# EAGLE design rfid_wifi_tft (EAGLE 7.6.0)

## Sheet 1 of 2
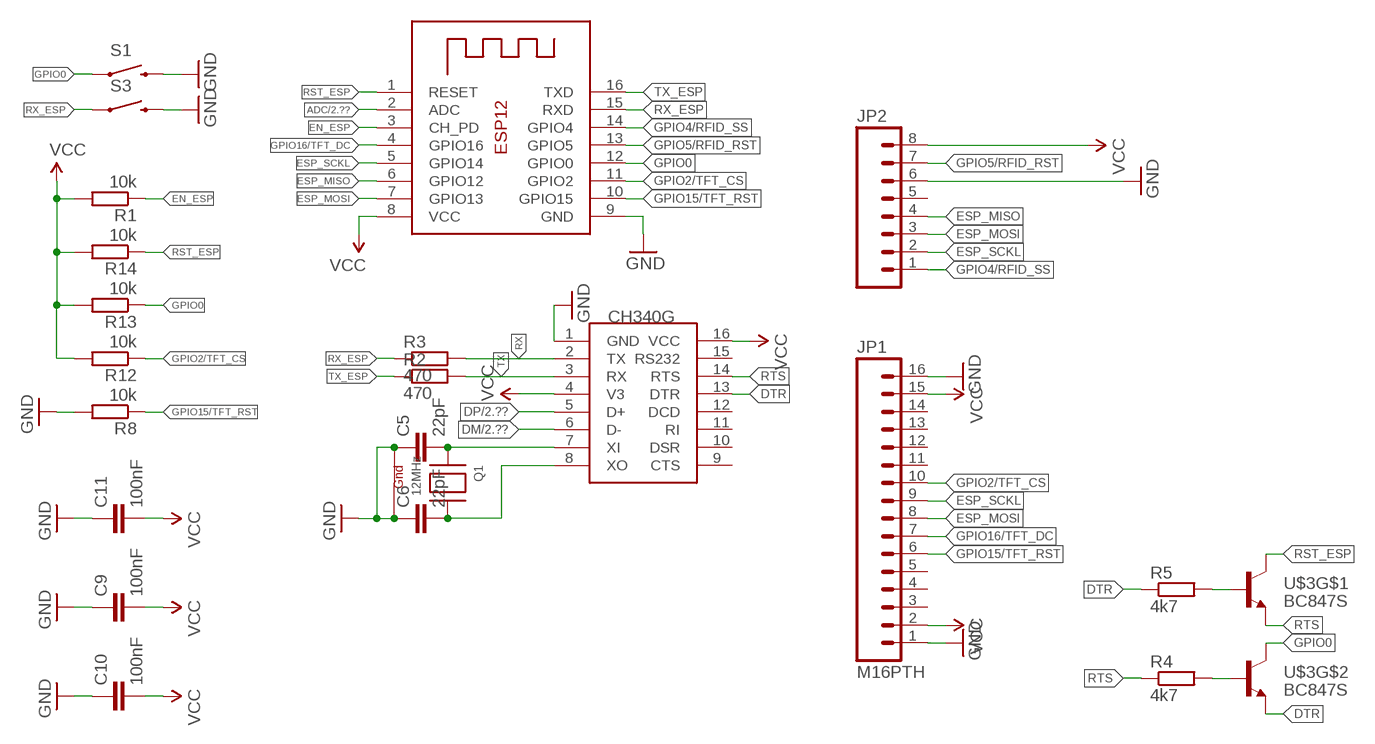
[diagram p0: schematic, sheet 1]

### Parts
C5  22pF  C-EUC0805  [C0805]
C6  22pF  C-EUC0805  [C0805]
C9  100nF  C-EUC0805  [C0805]
C10  100nF  C-EUC0805  [C0805]
C11  100nF  C-EUC0805  [C0805]
CH340G  CH340GCH340G  [SOIC16]
JP1  M16PTH  [1X16]
JP2  M08  [1X08_ROUND]
Q1  12MHz  XTAL-4-3225  [NX3225]
R1  10k  R-EU_R0603  [R0603]
R2  470  R-EU_R0603  [R0603]
R3  470  R-EU_R0603  [R0603]
R4  4k7  R-EU_R0603  [R0603]
R5  4k7  R-EU_R0603  [R0603]
R8  10k  R-EU_R0603  [R0603]
R12  10k  R-EU_R0603  [R0603]
R13  10k  R-EU_R0603  [R0603]
R14  10k  R-EU_R0603  [R0603]
S1  SWITCH-MOMENTARY-2-SMD-1101NE  [TACTILE-SWITCH-1101NE]
S3  SWITCH-MOMENTARY-2-SMD-1101NE  [TACTILE-SWITCH-1101NE]
U$3  BC847S  MMDT3904  [SOT363]
X1  ESP-12  [ESP-12]

### Nets
ADC: X1.2(ADC) ; also sheet 2
DM: CH340G.6(D-) ; also sheet 2
DP: CH340G.5(D+) ; also sheet 2
DTR: CH340G.13(DTR) R5.1 U$3.1(E)
EN_ESP: R1.1 X1.3(CH_PD)
ESP_MISO: JP2.4 X1.6(GPIO12)
ESP_MOSI: JP1.8 JP2.3 X1.7(GPIO13)
ESP_SCKL: JP1.9 JP2.2 X1.5(GPIO14)
GND: C5.1 C6.1 C9.1 C10.1 C11.1 CH340G.1(GND) JP1.1 JP1.16 JP2.6 Q1.2(G2) Q1.4(G1) R8.2 S1.P$2 S3.P$2 X1.9(GND) ; also sheet 2
GPIO0: R13.1 S1.P$1 U$3.6(C) X1.12(GPIO0)
GPIO2/TFT_CS: JP1.10 R12.1 X1.11(GPIO2)
GPIO4/RFID_SS: JP2.1 X1.14(GPIO4)
GPIO5/RFID_RST: JP2.7 X1.13(GPIO5)
GPIO15/TFT_RST: JP1.6 R8.1 X1.10(GPIO15)
GPIO16/TFT_DC: JP1.7 X1.4(GPIO16)
N$17: C5.2 CH340G.7(XI) Q1.1(X1)
N$24: C6.2 CH340G.8(XO) Q1.3(X2)
N$25: R5.2 U$3.5(B)
N$28: R4.2 U$3.2(B)
RST_ESP: R14.1 U$3.3(C) X1.1(RESET)
RTS: CH340G.14(RTS) R4.1 U$3.4(E)
RX: CH340G.2(TX) R3.2
RX_ESP: R3.1 S3.P$1 X1.15(RXD)
TX: CH340G.3(RX) R2.2
TX_ESP: R2.1 X1.16(TXD)
VCC: C9.2 C10.2 C11.2 CH340G.4(V3) CH340G.16(VCC) JP1.2 JP1.15 JP2.8 R1.2 R12.2 R13.2 R14.2 X1.8(VCC) ; also sheet 2
Unconnected: CH340G.9(CTS) CH340G.10(DSR) CH340G.11(RI) CH340G.12(DCD) CH340G.15(RS232) JP1.3 JP1.4 JP1.5 JP1.11 JP1.12 JP1.13 JP1.14 JP2.5

## Sheet 2 of 2
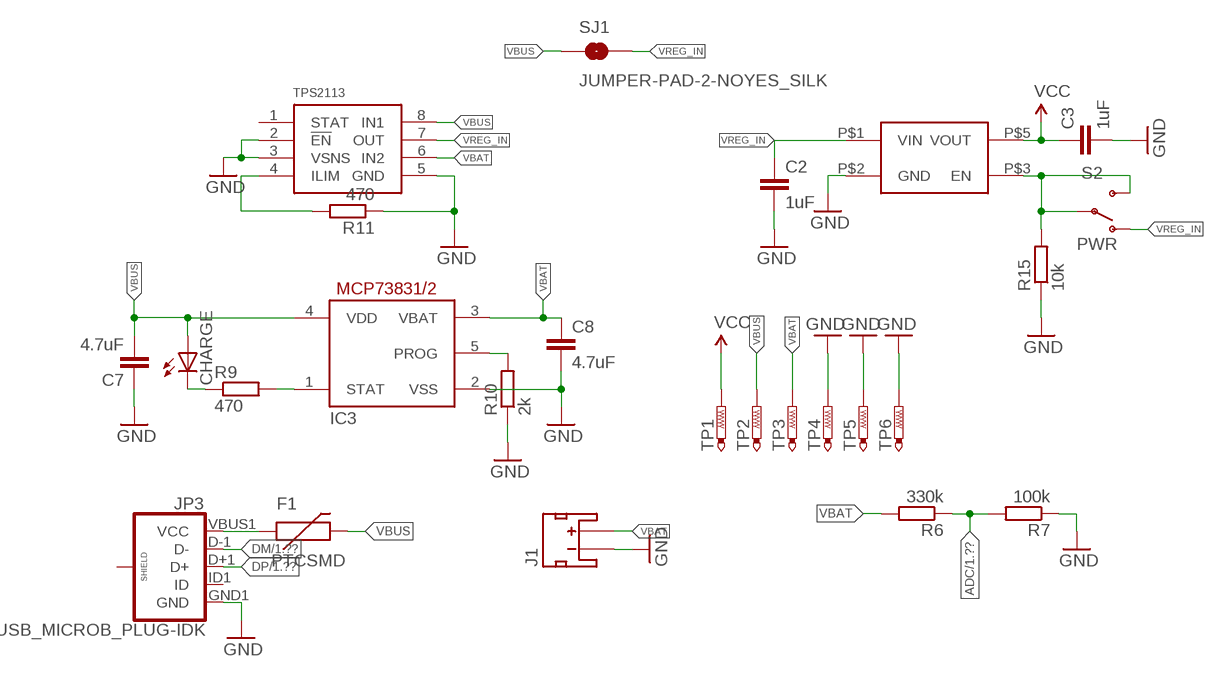
[diagram p1: schematic, sheet 2]

### Parts
C2  1uF  C-EUC0805  [C0805]
C3  1uF  C-EUC0805  [C0805]
C7  4.7uF  C-EUC0805  [C0805]
C8  4.7uF  C-EUC0805  [C0805]
CHARGE  LEDCHIP-LED0805  [CHIP-LED0805]
F1  PTCSMD  [PTC-1206]
IC3  MCP73831  MCP73831/OT  [SOT23-5L]
J1  JST_2MM_MALE  [JST-2-SMD]
JP3  USB_MICROB_PLUG-IDK  [USB-AB-MICRO-SMD_SLOT]
R6  330k  R-EU_R0603  [R0603]
R7  100k  R-EU_R0603  [R0603]
R9  470  R-EU_R0603  [R0603]
R10  2k  R-EU_R0603  [R0603]
R11  470  R-EU_R0603  [R0603]
R15  10k  R-EU_R0603  [R0603]
S2  PWR  SWITCH-SPDT-SMD-A  [SWITCH-SPST-SMD-A]
SJ1  JUMPER-PAD-2-NOYES_SILK  [PAD-JUMPER-2-NO_YES_SILK]
TP1  PTR1B1,27  [B1,27]
TP2  PTR1B1,27  [B1,27]
TP3  PTR1B1,27  [B1,27]
TP4  PTR1B1,27  [B1,27]
TP5  PTR1B1,27  [B1,27]
TP6  PTR1B1,27  [B1,27]
U$4  TPS2113-PW  [TEXAS-PW]
U$9  AP2112KAP2112K  [AP2112]

### Nets
ADC: R6.1 R7.2 ; also sheet 1
DM: JP3.D-1(D-) ; also sheet 1
DP: JP3.D+1(D+) ; also sheet 1
GND: C2.2 C3.2 C7.1 C8.2 IC3.2(VSS) J1.1(-) JP3.GND1(GND) R7.1 R10.1 R11.1 R15.1 TP4.TP TP5.TP TP6.TP U$4.2(!EN) U$4.3(VSNS) U$4.5(GND) U$9.P$2(GND) ; also sheet 1
N$12: IC3.1(STAT) R9.2
N$15: CHARGE.C R9.1
N$20: R11.2 U$4.4(ILIM)
N$21: IC3.5(PROG) R10.2
VBAT: C8.1 IC3.3(VBAT) J1.2(+) R6.2 TP3.TP U$4.6(IN2)
VBUS: C7.2 CHARGE.A F1.2 IC3.4(VDD) SJ1.1 TP2.TP U$4.8(IN1)
VCC: C3.1 TP1.TP U$9.P$5(VOUT) ; also sheet 1
VREG_EN: R15.2 S2.2(P) S2.3(S) U$9.P$3(EN)
VREG_IN: C2.1 S2.1(O) SJ1.2 U$4.7(OUT) U$9.P$1(VIN)
VUSB: F1.1 JP3.VBUS1(VCC)
Unconnected: J1.NC1(PAD1) J1.NC2(PAD2) JP3.ID1(ID) JP3.P$1(SHIELD) JP3.P$2(SHIELD) JP3.P$3(SHIELD) JP3.P$4(SHIELD) U$4.1(STAT)

## Library data of the parts
C2 C3 C5-C11 = rcl:C-EU: CAPACITOR, European symbol
CH340G = ch340g:CH340G: USB to TTL RS232 converter
CHARGE = led:LED: LED OSRAM: - CHIPLED LG R971, LG N971, LY N971, LG Q971, LY Q971, LO R971, LY R971 LH N974, LH R974 LS Q976, LO Q976, LY Q976 LO Q996 - Hyper CHIPLED LW Q18S LB Q993, LB Q99A, LB R99A - SideLED LS A670, LO A670, LY A670, LG A670, LP A670 LB A673, LV A673, LT A673, LW A673 LH A674 LY A675 LS A676, LA A676, LO A676, LY A676, LW A676 LS A679, LY A679, LG A679 - Hyper Micro SIDELED® LS Y876, LA Y876, LO Y876, LY Y876 LT Y87S - SmartLED LW L88C, LW L88S LB L89C, LB L89S, LG L890 LS L89K, LO L89K, LY L89K LS L896, LA L896, LO L896, LY L896 - TOPLED LS T670, LO T670, LY T670, LG T670, LP T670 LSG T670, LSP T670, LSY T670, LOP T670, LYG T670 LG T671, LOG T671, LSG T671 LB T673, LV T673, LT T673, LW T673 LH T674 LS T676, LA T676, LO T676, LY T676, LB T676, LH T676, LSB T676, LW T676 LB T67C, LV T67C, LT T67C, LS T67K, LO T67K, LY T67K, LW E67C LS E67B, LA E67B, LO E67B, LY E67B, LB E67C, LV E67C, LT E67C LW T67C LS T679, LY T679, LG T679 LS T770, LO T770, LY T770, LG T770, LP T770 LB T773, LV T773, LT T773, LW T773 LH T774 LS E675, LA E675, LY E675, LS T675 LS T776, LA T776, LO T776, LY T776, LB T776 LHGB T686 LT T68C, LB T68C - Hyper Mini TOPLED® LB M676 - Mini TOPLED Santana® LG M470 LS M47K, LO M47K, LY M47K Source: http://www.osram.convergy.de LUXEON: - LUMILED® LXK2-PW12-R00, LXK2-PW12-S00, LXK2-PW14-U00, LXK2-PW14-V00 LXK2-PM12-R00, LXK2-PM12-S00, LXK2-PM14-U00 LXK2-PE12-Q00, LXK2-PE12-R00, LXK2-PE12-S00, LXK2-PE14-T00, LXK2-PE14-U00 LXK2-PB12-K00, LXK2-PB12-L00, LXK2-PB12-M00, LXK2-PB14-N00, LXK2-PB14-P00, LXK2-PB14-Q00 LXK2-PR12-L00, LXK2-PR12-M00, LXK2-PR14-Q00, LXK2-PR14-R00 LXK2-PD12-Q00, LXK2-PD12-R00, LXK2-PD12-S00 LXK2-PH12-R00, LXK2-PH12-S00 LXK2-PL12-P00, LXK2-PL12-Q00, LXK2-PL12-R00 Source: www.luxeon.com KINGBRIGHT: KA-3528ASYC Source: www.kingbright.com
F1 = SparkFun-PowerIC:PTC: Resettable Fuse PTC Resettable Fuse. Spark Fun Electronics SKU : COM-08357; PROD_ID: RES-11150
IC3 = adafruit:MCP73831: MCP73831/2 Miniature Single-Cell, Fully Integrated Li-Ion, Li-Polymer Charge Management Controllers. Nice and small simple lipoly charge controller, with adjustable current and status output (LED) http://www.ladyada.net/library/pcb/eaglelibrary.html
J1 = SparkFun-Connectors:JST_2MM_MALE: Mates to single-cell LiPo batteries. CONN-08352; PROD_ID: CONN-08352
JP1 = SparkFun-Connectors:M16: 1x16 .1" header
JP2 = SparkFun-Connectors:M08: Header 8 Standard 8-pin 0.1" header. Use with straight break away headers (SKU : PRT-00116), right angle break away headers (PRT-00553), swiss pins (PRT-00743), machine pins (PRT-00117), and female headers (PRT-00115).
JP3 = SparkFun-Connectors:USB_MICROB_PLUG: USB Micro-B connectors Some male, some female. Watch your step!
Q1 = adafruit:XTAL-4: Classic 4-pin 3.2 x 2.5mm crystal
R1-R15 = rcl:R-EU_: RESISTOR, European symbol
S1 S3 = SparkFun-Electromechanical:SWITCH-MOMENTARY-2: Various NO switches- pushbuttons, reed, etc
S2 = SparkFun-Electromechanical:SWITCH-SPDT: SPDT Switch Simple slide switch, Spark Fun Electronics SKU : COM-00102 DPDT SMT slide switch, AYZ0202, SWCH-08179
SJ1 = SparkFun-Passives:JUMPER-PAD-2-NO
TP1-TP6 = testpad:PTR1: TEST PIN
U$3 = SparkFun-DiscreteSemi:MMDT3904: Dual NPN transistor
U$4 = TPS2113:TPS2113-PW
U$9 = TPS2113:AP2112K
X1 = adafruit:ESP-12

## Board
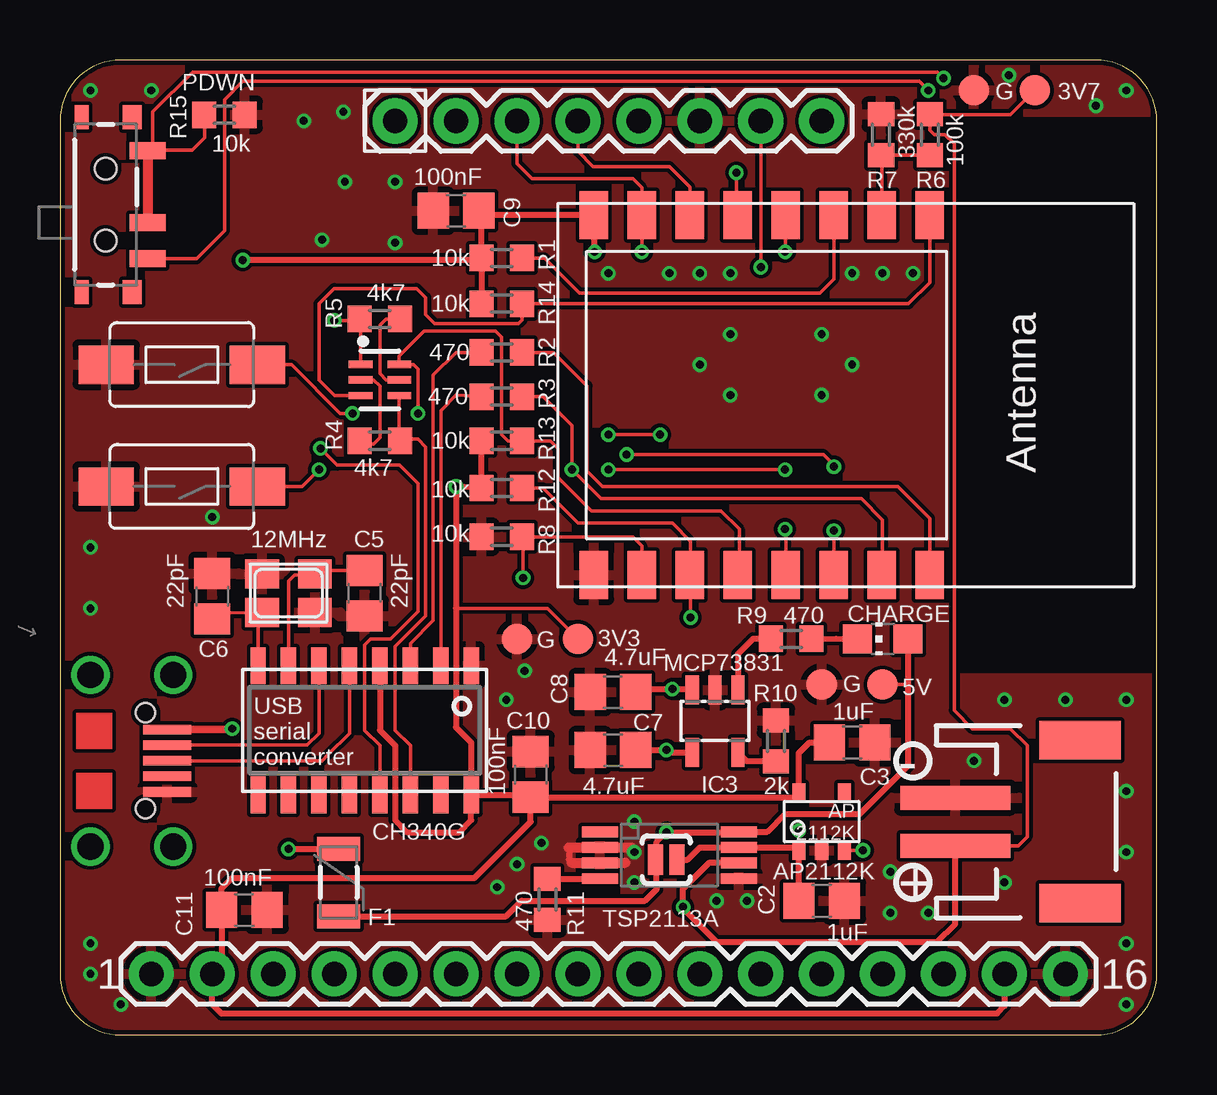
[diagram p2: board, top side]
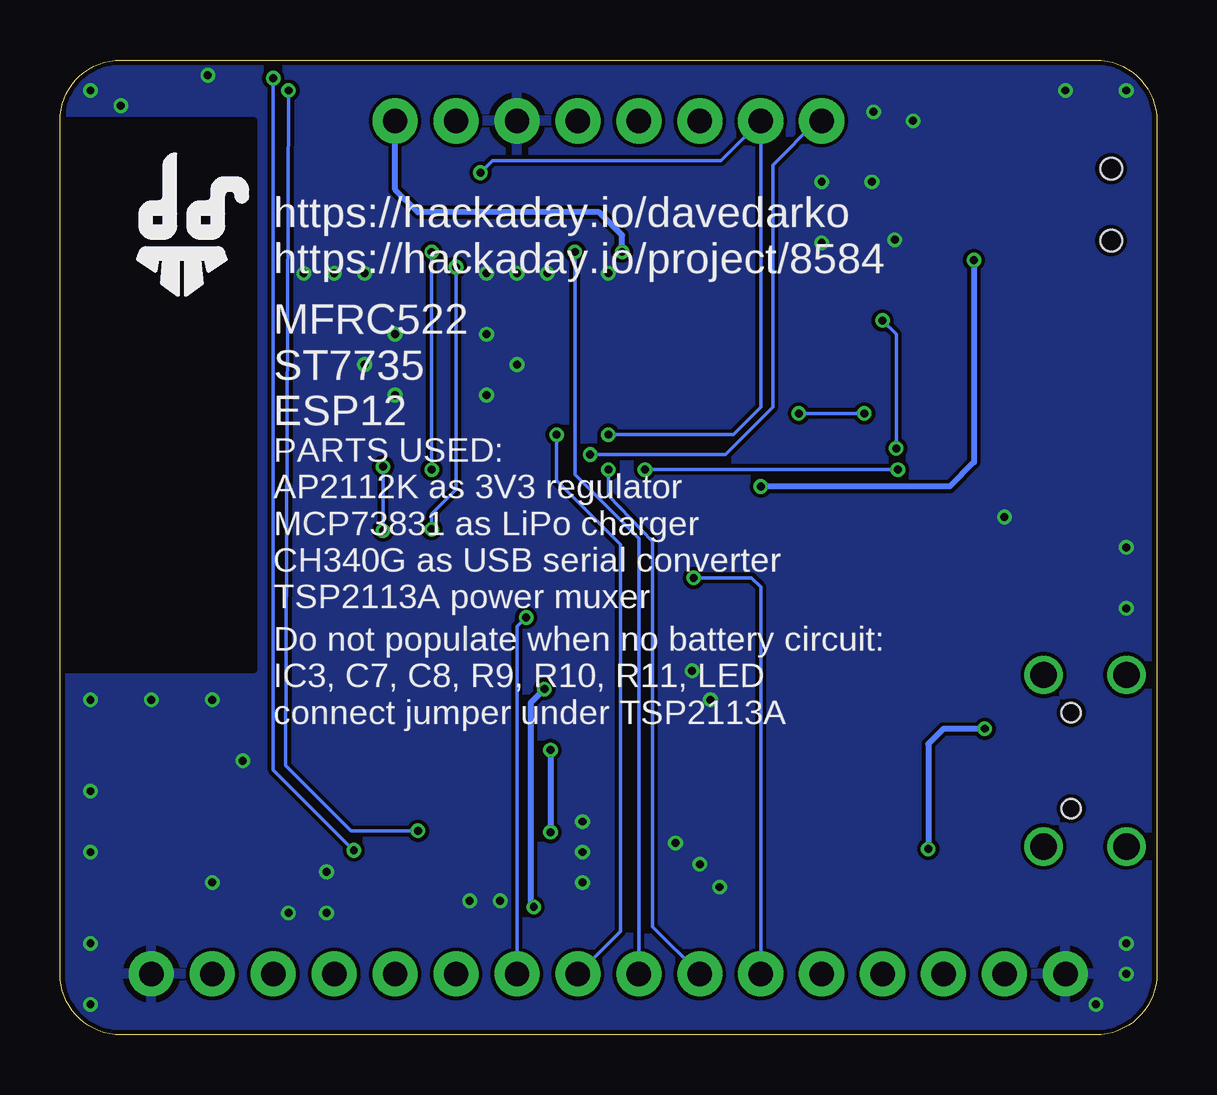
[diagram p3: board, bottom side, seen from below]

Size 45.72 x 40.64 mm. Coordinates in mm from the lower left corner, seen from the top.
Outline: 0,38.1 0,2.54 arc90 2.54,0 43.18,0 arc90 45.72,2.54 45.72,38.1 arc90 43.18,40.64 2.54,40.64 arc90 0,38.1
Copper layers (1*16): Top 0.035mm / dielectric 1.5mm / Bottom 0.035mm
Design rules "aisler_go_2layer *": minimum track width 0.1mm, minimum drill 0.2mm, track to track 0.1mm, track to pad 0.1mm, pad to pad 0.1mm, via to via 0.1mm, smd to smd 0.1mm, copper to edge 0.2mm, drill to drill 0.21mm, minimum pad ring 0.25mm, minimum via ring 0.05mm, stop-mask expansion 0.01mm, vias tented up to drill 200mil, thermal gap 10mil
tRestrict: area 37.7,15.2 to 45.3,38.1
bRestrict: area 37.7,15.2 to 45.3,38.1

### Footprints (pad centres in the part's own frame; a part is rotated, then mirrored left to right if it is on the bottom)
C0805 = smd 1.3 x 1.5: 1 -0.95,0; 2 0.95,0
SOIC16 = smd 0.635 x 1.524: 1 -4.445,-2.695; 2 -3.175,-2.695; 3 -1.905,-2.695; 4 -0.635,-2.695; 5 0.635,-2.695; 6 1.905,-2.695; 7 3.175,-2.695; 8 4.445,-2.695; 9 4.445,2.695; 10 3.175,2.695; 11 1.905,2.695; 12 0.635,2.695; 13 -0.635,2.695; 14 -1.905,2.695; 15 -3.175,2.695; 16 -4.445,2.695
CHIP-LED0805 = smd 1.2 x 1.2: A 0,-1.05; C 0,1.05
PTC-1206 = smd 1 x 1.8: 1 -1.4,0; 2 1.4,0
SOT23-5L = smd 0.55 x 1.2: 1 -0.95,-1.3; 2 0,-1.3; 3 0.95,-1.3; 4 0.95,1.3; 5 -0.95,1.3
JST-2-SMD = smd 1 x 4.6: 1 -1,-3.7; 2 1,-3.7 | smd 1.6 x 3.4: NC1 -3.4,1.5; NC2 3.4,1.5
1X16 = drill 1.016 pad 1.88: 1 0,0; 2 2.54,0; 3 5.08,0; 4 7.62,0; 5 10.16,0; 6 12.7,0; 7 15.24,0; 8 17.78,0; 9 20.32,0; 10 22.86,0; 11 25.4,0; 12 27.94,0; 13 30.48,0; 14 33.02,0; 15 35.56,0; 16 38.1,0
1X08_ROUND = drill 1.016 pad 1.88: 1 0,0; 2 2.54,0; 3 5.08,0; 4 7.62,0; 5 10.16,0; 6 12.7,0; 7 15.24,0; 8 17.78,0
USB-AB-MICRO-SMD_SLOT = smd 2 x 0.4: D+1 3.2,0; D-1 3.2,0.65; GND1 3.2,-1.3; ID1 3.2,-0.65; VBUS1 3.2,1.3 | drill 1.1: P$1 0,3.575; P$2 0,-3.575; P$3 3.45,-3.575; P$4 3.45,3.575 | hole 0.8: 2.3,2; 2.3,-2
NX3225 = smd 1.4 x 1.2: 1 -1.1,-0.8; 2 1.1,-0.8; 3 1.1,0.8; 4 -1.1,0.8
R0603 = smd 1 x 1.1: 1 -0.85,0; 2 0.85,0
TACTILE-SWITCH-1101NE = smd 2.3 x 1.6: P$1 -3.15,0; P$2 3.15,0
SWITCH-SPST-SMD-A = smd 0.7 x 1.5: 1 -2.25,-1.75; 2 -0.75,-1.75; 3 2.25,-1.75 | smd 1 x 0.6: GND1 -3.65,1; GND3 3.65,1 | smd 1 x 0.8: GND2 -3.65,-1.1; GND4 3.65,-1.1 | hole 0.9: -1.5,0; 1.5,0
PAD-JUMPER-2-NO_YES_SILK = smd 0.635 x 1.27: 1 -0.45,0; 2 0.45,0
B1,27 = smd 1.27 x 1.27: TP 0,0
SOT363 = smd 0.3 x 0.99: 1 -0.65,-0.8; 2 0,-0.8; 3 0.65,-0.8; 4 0.65,0.81; 5 0,0.81; 6 -0.65,0.81
TEXAS-PW = smd 1.5 x 0.45: 1 -2.9,0.975; 2 -2.9,0.325; 3 -2.9,-0.325; 4 -2.9,-0.975; 5 2.9,-0.975; 6 2.9,-0.325; 7 2.9,0.325; 8 2.9,0.975
AP2112 = smd 0.55 x 0.8: P$1 0.95,1.2; P$2 0,1.2; P$3 -0.95,1.2; P$4 -0.95,-1.2; P$5 0.95,-1.2
ESP-12 = smd 2 x 1.2: 1 -7.5,4.5; 2 -7.5,2.5; 3 -7.5,0.5; 4 -7.5,-1.5; 5 -7.5,-3.5; 6 -7.5,-5.5; 7 -7.5,-7.5; 8 -7.5,-9.5; 9 7.5,-9.5; 10 7.5,-7.5; 11 7.5,-5.5; 12 7.5,-3.5; 13 7.5,-1.5; 14 7.5,0.5; 15 7.5,2.5; 16 7.5,4.5

### Placement (x,y rotation side)
C2  31.75,5.59 0 top
C3  33.02,12.19 0 top
C5  12.7,18.41 90 top
C6  6.35,18.29 270 top
C7  23.05,11.87 0 top
C8  23.05,14.29 180 top
C9  16.51,34.35 0 top
C10  19.62,10.86 270 top
C11  7.68,5.21 180 top
CH340G  12.7,12.7 180 top
CHARGE  34.29,16.51 90 top
F1  11.62,6.35 270 top
IC3  27.3,13.08 180 top
J1  41.02,8.89 270 top
JP1  3.81,2.54 0 top
JP2  13.97,38.1 0 top
JP3  1.27,11.43 0 top
Q1  9.53,18.41 180 top
R1  18.41,32.38 180 top
R2  18.41,28.45 180 top
R3  18.41,26.61 180 top
R4  13.34,24.77 180 top
R5  13.34,29.84 0 top
R6  36.26,37.53 90 top
R7  34.23,37.53 270 top
R8  18.41,20.76 180 top
R9  30.48,16.51 180 top
R10  29.84,12.26 270 top
R11  20.32,5.65 90 top
R12  18.41,22.8 180 top
R13  18.41,24.77 180 top
R14  18.41,30.48 180 top
R15  6.86,38.35 180 top
S1  5.08,27.94 180 top
S2  1.91,34.61 90 top
S3  5.08,22.86 180 top
SJ1  25.27,7.3 0 top
TP1  21.59,16.51 0 top
TP2  34.29,14.61 0 top
TP3  40.64,39.37 0 top
TP4  31.75,14.61 0 top
TP5  38.1,39.37 0 top
TP6  19.05,16.51 0 top
U$1  [DAVEDARKO_GOLD]  9.59,34.99 0 top
U$2  [DAVEDARKO2_LOGO]  40.64,33.02 0 bottom
U$3  13.34,27.3 270 top
U$4  25.4,7.49 0 top
U$9  31.75,8.89 180 top
X1  31.75,26.67 270 top

### Tracks (layer width: path | path; a pad name or v marks a point on that pad's centre or on a via)
ADC
  Top 0.152: X1.2 34.25,36.64 R7.2 R6.1
DM
  Top 0.152: CH340G.6 10.79,12.57 10.3,12.08 JP3.D-1
DP
  Top 0.152: CH340G.5 12.06,12.57 11.18,11.68 10.92,11.43 JP3.D+1
DTR  (via drill 0.33 pad 0.61)
  Top 0.152: U$3.1 12.54,29.8 R5.1 12.42,29.78 v11.43,29.78 | CH340G.13 13.34,12.06 12.7,12.7 12.7,16.26 12.95,16.51 13.78,16.51 14.92,17.65 14.92,22.99 14.16,23.75 11.56,23.75 v10.86,24.45
  Bottom 0.152: v10.86,24.45 10.86,29.21 v11.43,29.78
EN_ESP
  Top 0.152: X1.3 32.25,33.14 32.26,31.5 31.69,30.92 21.65,30.92 20.19,32.38 R1.1
ESP_MISO
  Top 0.152: X1.6 26.25,35.34 25.4,36.2 22.23,36.2 21.59,36.83 JP2.4
ESP_MOSI  (via drill 0.33 pad 0.61)
  Top 0.152: JP2.3 19.05,36.32 19.68,35.69 23.88,35.69 24.25,35.31 X1.7 v24.26,32.64
  Bottom 0.152: JP1.8 21.59,20.7 24.26,23.37 v24.26,32.64
ESP_SCKL  (via drill 0.33 pad 0.61)
  Top 0.152: v28.19,35.94 28.19,34.23 X1.5 | v25.02,25.02 v22.86,25.02
  Bottom 0.152: v28.19,35.94 27.69,36.45 18.16,36.45 JP2.2 16.51,26.16 17.65,25.02 v22.86,25.02 | JP1.9 22.35,4.32 22.35,20.45 25.02,23.11 v25.02,25.02
GND  (via drill 0.33 pad 0.61)
  Top 0.254: 21.21,7.81 21.21,7.3 21.34,7.18 | U$4.3 23.55,7.17 23.56,7.18
  Top 0.406: 21.34,7.18 23.56,7.18 | 21.21,7.81 23.81,7.81
  other vias: 23.94,7.62 23.94,6.35 23.94,8.89 28.64,5.59 27.37,5.59 19.05,7.11 18.22,6.16 20.07,8 34.61,6.79 39.37,6.35 36.2,5.08 44.45,7.62 44.45,13.97 44.45,3.81 41.91,13.97 44.45,10.16 18.61,13.97 19.37,15.18 27.94,29.21 27.94,26.67 26.67,27.94 31.75,29.21 33.02,27.94 31.75,26.67 43.18,38.73 44.45,1.27 44.45,39.37 39.56,40.01 11.81,38.48 10.16,38.1 11.87,35.56 13.97,35.56 10.92,33.15 13.97,33.02 1.27,39.37 3.81,39.37 6.35,21.59 1.27,17.78 1.27,20.32 2.54,1.27 1.27,2.54 1.27,3.81 34.61,5.08 38.1,11.43 39.37,13.97 33.02,31.75 34.29,31.75 35.56,31.75 27.94,31.75 26.67,31.75 25.4,31.75 22.86,31.75
  pour Bottom (isolate 0.152): 48.26,41.99 -2.54,41.99 -2.54,-1.27 48.26,-1.27
  pour Top (isolate 0.152): -1.27,43.18 46.99,43.18 46.99,-2.54 -1.27,-2.54
GPIO0  (via drill 0.33 pad 0.61)
  Top 0.152: X1.12 28.32,19.24 28.32,21.08 27.56,21.84 22.16,21.84 20.77,23.24 20.77,24.45 20.45,24.77 R13.1 18.67,24.77 18.41,25.02 18.41,29.08 18.16,29.34 15.18,29.34 14.14,28.3 U$3.6 14.73,27.94 14.92,27.75 v14.92,25.91 | S1.P$1 9.65,27.94 11.68,25.91 v12.19,25.91
  Bottom 0.152: v12.19,25.91 v14.92,25.91
GPIO2/TFT_CS  (via drill 0.33 pad 0.61)
  Top 0.152: v26.29,17.4 26.29,19.13 X1.11 26.29,19.21 26.29,20.57 25.53,21.34 21.59,21.34 20.13,22.8 R12.1
  Bottom 0.152: JP1.10 26.67,17.02 v26.29,17.4
GPIO4/RFID_SS  (via drill 0.33 pad 0.61)
  Top 0.152: X1.14 v32.25,21.01 v32.26,21.02 | v32.26,23.69 32.26,23.75 31.81,24.19 v23.62,24.19
  Bottom 0.152: v32.26,21.02 v32.26,23.69 | v23.62,24.19 17.97,24.19 16,26.16 16,36.26 14.16,38.1 JP2.1
GPIO5/RFID_RST  (via drill 0.33 pad 0.61)
  Top 0.152: X1.13 30.25,21.06 v30.23,21.08 | v29.21,32 JP2.7
  Bottom 0.152: v30.23,21.08 30.23,21.72 29.21,22.73 v29.21,32
GPIO15/TFT_RST  (via drill 0.33 pad 0.61)
  Top 0.152: X1.10 24.26,20.38 23.88,20.77 R8.1 19.3,20.92 v19.3,19.05
  Top 0.254: X1.10
  Bottom 0.152: JP1.6 16.51,18.67 16.89,19.05 v19.3,19.05
GPIO16/TFT_DC  (via drill 0.33 pad 0.61)
  Top 0.152: v30.23,32.64 30.25,33.63 X1.4 | v22.86,23.56 v30.23,23.56
  Bottom 0.152: JP1.7 21.02,4.51 21.02,20.57 22.86,22.48 v22.86,23.56 | v30.23,23.56 v30.23,32.64
N$12
  Top 0.254: R9.2 28.89,16.51 28.26,15.88 IC3.1
N$15
  Top 0.254: R9.1 32.35,16.52 CHARGE.C
N$17
  Top 0.152: CH340G.7 9.53,18.92 9.78,19.18 10.33,19.18 Q1.1 | 10.52,19.36 Q1.1 | C5.2 10.47,19.36 Q1.1
N$20
  Top 0.254: R11.2 22.48,6.5 U$4.4
N$21
  Top 0.254: 28.39,11.85 IC3.5 28.63,11.4 R10.2
N$24
  Top 0.152: C6.2 6.43,17.59 Q1.3 8.26,17.53 CH340G.8
N$25
  Top 0.152: R5.2 13.59,29.84 13.34,29.59 13.34,27.56 13.59,27.3 U$3.5
N$28
  Top 0.152: U$3.2 13.08,27.3 13.34,27.05 13.34,24.89 13.08,24.64 12.61,24.64 R4.2
RST_ESP
  Top 0.152: U$3.3 11.45,26.66 10.79,27.3 10.79,30.48 11.43,31.11 14.86,31.11 15.24,30.73 15.24,30.04 15.62,29.65 19.11,29.65 19.27,29.81 R14.1 35.37,30.48 36.26,31.37 X1.1
RTS
  Top 0.152: U$3.4 14.14,24.8 R4.1 14.25,24.83 14.92,24.83 15.24,24.51 15.24,17.46 13.97,16.19 13.97,12.7 14.61,12.06 CH340G.14
RX
  Top 0.152: CH340G.2 15.88,26.04 16.51,26.67 R3.2
RX_ESP  (via drill 0.33 pad 0.61)
  Top 0.152: X1.15 34.29,19.21 34.29,21.46 33.4,22.35 22.54,22.35 v21.34,23.56 21.34,25.4 20.13,26.61 R3.1 | S3.P$1 10.1,22.86 v10.79,23.56
  Bottom 0.152: v10.79,23.56 v21.34,23.56
TX
  Top 0.152: CH340G.3 14.61,16.32 15.56,17.27 15.56,27.5 16.51,28.45 R2.2
TX_ESP
  Top 0.152: X1.16 36.25,21.54 34.92,22.86 22.61,22.86 21.97,23.5 21.97,27.05 20.57,28.45 R2.1
VBAT  (via drill 0.33 pad 0.61)
  Top 0.152: J1.2 38.23,7.87 39.94,7.87 40.32,8.26 40.32,12.06 39.62,12.76 38.04,12.76 37.27,13.53 37.27,37.15 36.89,37.53 36.45,37.53 36.26,37.72 R6.2 arc-90 36.17,38.35 39.62,38.35 TP3.TP
  Top 0.254: 26.26,14.29 IC3.3 26.32,14.41 v25.53,14.41 24.13,14.41 C8.1 | U$4.6 27.04,7.17 25.97,6.1 v25.97,5.33 26.04,5.21 27.37,3.87 36.58,3.87 37.32,4.62 J1.2
  Bottom 0.254: v25.53,14.41 26.1,13.84 26.1,5.52 v25.97,5.33
VBUS  (via drill 0.33 pad 0.61)
  Top 0.152: TP2.TP 35.28,14.61 35.34,14.54
  Top 0.254: F1.2 18.6,4.95 19.24,5.59 24.38,5.59 24.87,6.08 SJ1.1 24.87,8.04 v25.27,8.45 28.28,8.45 U$4.8 29.49,8.47 30.23,9.21 33.34,9.21 35.34,11.21 35.34,14.54 CHARGE.A | C7.2 v25.27,11.87 25.49,11.78 IC3.4
  Bottom 0.254: v25.27,11.87 v25.27,8.45
VCC  (via drill 0.33 pad 0.61)
  Top 0.152: TP1.TP 20.32,17.78 16.51,17.78
  Top 0.254: 17.58,34.17 X1.8 22.25,32.68 v22.29,32.64 | R14.2 R1.2 17.57,34.19 C9.2 | R13.2 R12.2 v16.51,22.86 16.51,17.78 16.51,12.83 17.14,12.19 CH340G.16 | v7.62,32.29 7.66,32.29 7.68,32.32 17.5,32.32 | CH340G.4 13.34,12.7 13.97,12.06 13.97,8.95 14.48,8.45 16.64,8.45 17.14,8.95 CH340G.16 | C10.2 19.62,8.89 17.27,6.54 7.18,6.54 6.73,6.1 C11.2 6.73,2.92 JP1.2 6.35,1.27 6.73,0.89 39.05,0.89 39.37,1.21 JP1.15 | CH340G.16 19.52,10.01 C10.2 | C10.2 30.62,9.91 U$9.P$5 30.8,11.75 31.24,12.19 C3.1
  Top 0.406: 17.58,34.17 C9.2 | 17.5,32.32 R1.2
  Bottom 0.254: v22.29,32.64 22.29,33.34 23.24,34.29 30.8,34.29 31.75,35.24 JP2.8 | v7.62,32.29 7.62,23.88 8.64,22.86 v16.51,22.86
VREG_EN  (via drill 0.33 pad 0.61)
  Top 0.152: U$9.P$3 v33.47,7.69 | v36.83,39.88 36.58,40.13 5.52,40.13 3.87,38.48 3.87,36.89 | 3.87,36.89 S2.3 | 3.87,36.89 5.52,36.89 6.03,37.4 6.03,38.33 R15.2
  Top 0.406: S2.3 S2.2
  Bottom 0.152: v33.47,7.69 36.83,11.05 v36.83,39.88
VREG_IN  (via drill 0.33 pad 0.61)
  Top 0.152: S2.1 5.69,32.36 6.86,33.53 6.86,38.99 7.62,39.75 35.81,39.75 v36.2,39.37 | v30.8,8.51 U$9.P$1
  Top 0.254: C2.1 U$9.P$1 30.67,7.82 U$4.7 26.67,7.81 26.16,7.3 SJ1.2
  Bottom 0.152: v36.2,39.37 36.32,11.24 33.59,8.51 v30.8,8.51
VUSB  (via drill 0.33 pad 0.61)
  Top 0.254: 7.08,12.73 v7.18,12.76 | v9.53,7.75 F1.1
  Top 0.305: JP3.VBUS1 7.14,12.73 v7.18,12.76
  Bottom 0.254: v7.18,12.76 8.89,12.76 9.53,12.13 v9.53,7.75

### Text on the board
tNames: PDWN | G | 3V7 | 10k | 10k | 10k | 10k | 10k | 12MHz | G | 3V3 | G | 5V | USB / serial / converter | - | CH340G | AP2112K | TSP2113A | + | 1 | 16
bNames: https://hackaday.io/davedarko / https://hackaday.io/project/8584 | MFRC522 / ST7735 / ESP12 | PARTS USED: / AP2112K as 3V3 regulator / MCP73831 as LiPo charger / CH340G as USB serial converter / TSP2113A power muxer | Do not populate when no battery circuit: / IC3, C7, C8, R9, R10, R11, LED / connect jumper under TSP2113A